# Altium schematic sheet Top.SchDoc
size A3
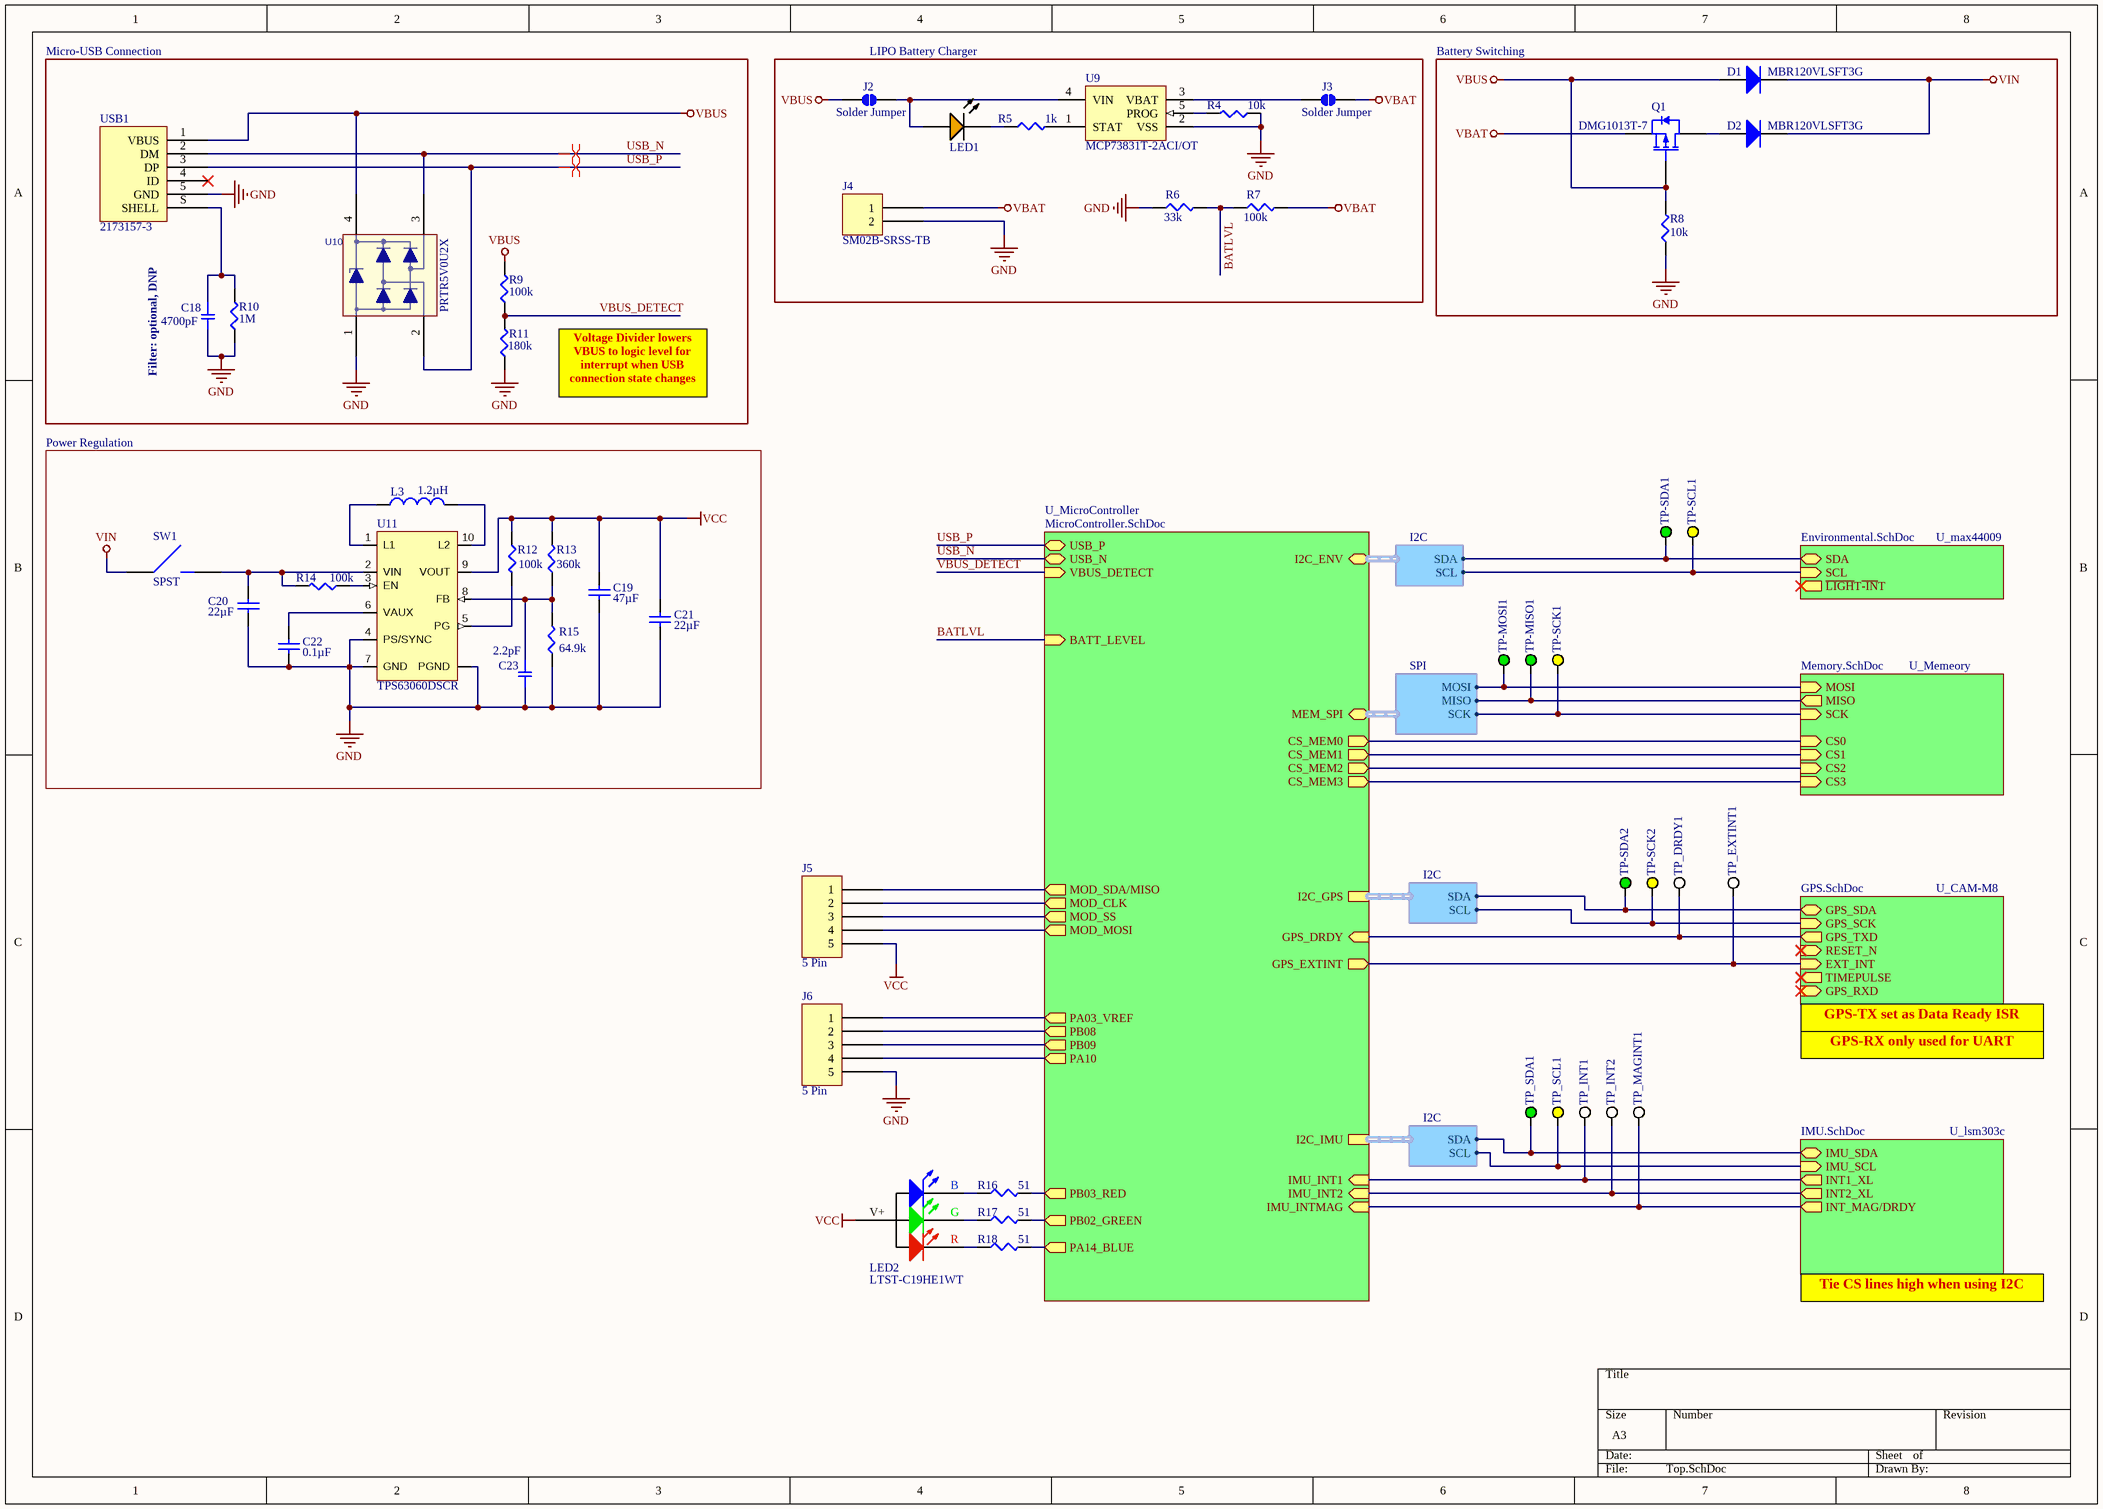
[diagram p0: Top.SchDoc]

## Parts
C18  value 4700pF  [SMD-0603C]  (hidden comment: GCM188R72A472KA37D)
C19  Capacitance: 47µF  [C0603N]  (hidden comment: CL21A476MQCLRNC)
C20  Capacitance: 22µF  [C0603N]  (hidden comment: CL21A226MQCLQNC)
C21  Capacitance: 22µF  [C0603N]  (hidden comment: CL21A226MQCLQNC)
C22  Capacitance: 0.1µF  [C0603N]  (hidden comment: CL10B104KO8NFNC)
C23  value 2.2pF  [SMD-0603C]  (hidden comment: GRM1885C1H2R2BA01D)
D1  MBR120VLSFT3G  [MBR120VLSFT3G]
D2  MBR120VLSFT3G  [MBR120VLSFT3G]
J2  Solder Jumper  [Jumper_1.5x3]
J3  Solder Jumper  [Jumper_1.5x3]
J4  SM02B-SRSS-TB  [JST SM02B-SRSS-TB]
J5  5 Pin  [PINHEAD127_1x5]
J6  5 Pin  [PINHEAD127_1x5]
L3  Inductance: 1.2µH  [IND_BOURNS_SRP40]  (hidden comment: SRP4020-1R2M)
LED1  LTST-C190KFKT  [LED_0603]  (value not drawn)
LED2  LTST-C19HE1WT  [LED_0606_160X160X35]
Q1  DMG1013T-7  [SOT50P175X90-3N]
R4  value 10k  [SMD-0603-RES]  (hidden comment: ERJ-3EKF1002V)
R5  value 1k  [SMD-0603-RES]  (hidden comment: ERJ-3EKF1001V)
R6  value 33k  [SMD-0603-RES]  (hidden comment: ERJ-3EKF3302V)
R7  value 100k  [SMD-0603-RES]  (hidden comment: ERJ-3EKF1003V)
R8  value 10k  [SMD-0603-RES]  (hidden comment: ERJ-3EKF1002V)
R9  value 100k  [SMD-0603-RES]  (hidden comment: ERJ-3EKF1003V)
R10  value 1M  [SMD-0603-RES]  (hidden comment: ERJ-3EKF1004V)
R11  value 180k  [SMD-0603-RES]  (hidden comment: ERJ-3EKF1803V)
R12  value 100k  [R0603N]  (hidden comment: ERJ-3EKF1003V)
R13  value 360k  [SMD-0603-RES]  (hidden comment: ERJ-3EKF3603V)
R14  value 100k  [R0603N]  (hidden comment: ERJ-3EKF1003V)
R15  value 64.9k  [SMD-0603-RES]  (hidden comment: ERJ-3EKF6492V)
R16  value 51  [SMD-0603-RES]  (hidden comment: ERJ-3EKF51R0V)
R17  value 51  [SMD-0603-RES]  (hidden comment: ERJ-3EKF51R0V)
R18  value 51  [SMD-0603-RES]  (hidden comment: ERJ-3EKF51R0V)
SW1  SPST  [PINHEAD254_1x2]
TP-MISO1  Test Point  [tp_30mil]  (value not drawn)
TP-MOSI1  Test Point  [tp_30mil]  (value not drawn)
TP-SCK1  Test Point  [tp_30mil]  (value not drawn)
TP-SCK2  Test Point  [tp_30mil]  (value not drawn)
TP-SCL1  Test Point  [tp_30mil]  (value not drawn)
TP-SDA1  Test Point  [tp_30mil]  (value not drawn)
TP-SDA2  Test Point  [tp_30mil]  (value not drawn)
TP_DRDY1  Test Point  [tp_30mil]  (value not drawn)
TP_EXTINT1  Test Point  [tp_30mil]  (value not drawn)
TP_INT1  Test Point  [tp_30mil]  (value not drawn)
TP_INT2  Test Point  [tp_30mil]  (value not drawn)
TP_MAGINT1  Test Point  [tp_30mil]  (value not drawn)
TP_SCL1  Test Point  [tp_30mil]  (value not drawn)
TP_SDA1  Test Point  [tp_30mil]  (value not drawn)
U9  MCP73831T-2ACI/OT  [SOT-23-5_MC]
U10  PRTR5V0U2X  [SOT143B]
U11  TPS63060DSCR  [TI_DRC_S-PVSON-N10]
USB1  2173157-3  [CONN_2173157]

## Blocks framed on the sheet
LIPO Battery Charger: J2-J4 LED1 R4-R7 U9
Battery Switching: D1 D2 Q1 R8
Power Regulation: C19-C23 L3 R12-R15 SW1 U11

## Sub-sheets
U_CAM-M8 = GPS.SchDoc: GPS_SCK (in), GPS_SDA (bidir), EXT_INT (in), TIMEPULSE (out), GPS_RXD (in), GPS_TXD (out), RESET_N (in)
U_lsm303c = IMU.SchDoc: IMU_SCL (in), IMU_SDA (bidir), INT1_XL (out), INT_MAG/DRDY (out), INT2_XL (out)
U_max44009 = Environmental.SchDoc: SDA (bidir), SCL (in), ~{LIGH}T~{-IN}T (out)
U_Memeory = Memory.SchDoc: MISO (out), SCK (in), MOSI (in), CS3 (in), CS1 (in), CS2 (in), CS0 (in)
U_MicroController = MicroController.SchDoc: USB_P (bidir), USB_N (bidir), I2C_GPS (harness I2C), VBUS_DETECT (in), BATT_LEVEL (in), GPS_DRDY (in), GPS_EXTINT (out), I2C_IMU (harness I2C), IMU_INT1 (in), IMU_INT2 (in), IMU_INTMAG (in), I2C_ENV (harness I2C), PB03_RED (out), PB02_GREEN (out), MEM_SPI (harness SPI), PA14_BLUE (out), PA10 (out), PA03_VREF (out), MOD_CLK (out), PB08 (out), MOD_MOSI (out), MOD_SS (out), PB09 (out), MOD_SDA/MISO (out), CS_MEM2 (out), CS_MEM1 (out), CS_MEM3 (out), CS_MEM0 (out)

## Harnesses
SPI: MOSI, MISO, SCK
I2C: SCL, SDA

## Nets
GND: C18.2 C19.2 C20.2 C21.2 C22.2 C23.2 J4.2 J6.5 R4.1 R6.1 R8.1 R10.1 R11.1 R15.1 U9.2(VSS) U10.1(GND) U11.4(PS/SYNC) U11.7(GND) U11.11(PGND) USB1.5(GND)
VBAT: J3.2 J4.1 Q1.2(S) R7.2
VBUS: D1.1(A) J2.1 Q1.1(G) R8.2 R9.2 U10.4(VCC) USB1.1(VBUS)
VCC: C19.1 C21.1 J5.5 LED2.4(A) R12.1 R13.2 U11.9(VOUT)
VIN: D1.2(K) D2.2(K) SW1.1
BATLVL: R6.2 R7.1 ; sheet U_MicroController/BATT_LEVEL
USB_N: U10.3(I/O2) USB1.2(DM) ; sheet U_MicroController/USB_N
USB_P: U10.2(I/O1) USB1.3(DP) ; sheet U_MicroController/USB_P
VBUS_DETECT: R9.1 R11.2 ; sheet U_MicroController/VBUS_DETECT
NetC18_1: C18.1 R10.2 USB1.S(SHELL)
NetC20_1: C20.1 R14.2 SW1.2 U11.2(VIN)
NetC22_1: C22.1 U11.6(VAUX)
NetC23_1: C23.1 R13.1 R15.2 U11.8(FB)
NetD2_1: D2.1(A) Q1.3(D)
NetJ2_2: J2.2 LED1.1(A) U9.4(VIN)
NetJ3_1: J3.1 U9.3(VBAT)
NetJ5_1: J5.1 ; sheet U_MicroController/MOD_SDA/MISO
NetJ5_2: J5.2 ; sheet U_MicroController/MOD_CLK
NetJ5_3: J5.3 ; sheet U_MicroController/MOD_SS
NetJ5_4: J5.4 ; sheet U_MicroController/MOD_MOSI
NetJ6_1: J6.1 ; sheet U_MicroController/PA03_VREF
NetJ6_2: J6.2 ; sheet U_MicroController/PB08
NetJ6_3: J6.3 ; sheet U_MicroController/PB09
NetJ6_4: J6.4 ; sheet U_MicroController/PA10
NetL3_1: L3.1 U11.1(L1)
NetL3_2: L3.2 U11.10(L2)
NetLED1_2: LED1.2(K) R5.1
NetLED2_1: LED2.1(R) R18.1
NetLED2_2: LED2.2(G) R17.1
NetLED2_3: LED2.3(B) R16.1
NetR4_2: R4.2 U9.5(PROG)
NetR5_2: R5.2 U9.1(STAT)
NetR12_2: R12.2 U11.5(PG)
NetR14_1: R14.1 U11.3(EN)
NetR16_2: R16.2 ; sheet U_MicroController/PB03_RED
NetR17_2: R17.2 ; sheet U_MicroController/PB02_GREEN
NetR18_2: R18.2 ; sheet U_MicroController/PA14_BLUE
NetTP-MISO1_1: TP-MISO1.1 ; sheet U_Memeory/MISO, sheet U_MicroController/MEM_SPI.MISO
NetTP-MOSI1_1: TP-MOSI1.1 ; sheet U_Memeory/MOSI, sheet U_MicroController/MEM_SPI.MOSI
NetTP-SCK1_1: TP-SCK1.1 ; sheet U_Memeory/SCK, sheet U_MicroController/MEM_SPI.SCK
NetTP-SCK2_1: TP-SCK2.1 ; sheet U_CAM-M8/GPS_SCK, sheet U_MicroController/I2C_GPS.SCL
NetTP-SCL1_1: TP-SCL1.1 ; sheet U_max44009/SCL, sheet U_MicroController/I2C_ENV.SCL
NetTP-SDA1_1: TP-SDA1.1 ; sheet U_max44009/SDA, sheet U_MicroController/I2C_ENV.SDA
NetTP-SDA2_1: TP-SDA2.1 ; sheet U_CAM-M8/GPS_SDA, sheet U_MicroController/I2C_GPS.SDA
NetTP_DRDY1_1: TP_DRDY1.1 ; sheet U_CAM-M8/GPS_TXD, sheet U_MicroController/GPS_DRDY
NetTP_EXTINT1_1: TP_EXTINT1.1 ; sheet U_CAM-M8/EXT_INT, sheet U_MicroController/GPS_EXTINT
NetTP_INT1_1: TP_INT1.1 ; sheet U_lsm303c/INT1_XL, sheet U_MicroController/IMU_INT1
NetTP_INT2_1: TP_INT2.1 ; sheet U_lsm303c/INT2_XL, sheet U_MicroController/IMU_INT2
NetTP_MAGINT1_1: TP_MAGINT1.1 ; sheet U_lsm303c/INT_MAG/DRDY, sheet U_MicroController/IMU_INTMAG
NetTP_SCL1_1: TP_SCL1.1 ; sheet U_lsm303c/IMU_SCL, sheet U_MicroController/I2C_IMU.SCL
NetTP_SDA1_1: TP_SDA1.1 ; sheet U_lsm303c/IMU_SDA, sheet U_MicroController/I2C_IMU.SDA
(unnamed): sheet U_Memeory/CS3, sheet U_MicroController/CS_MEM3
(unnamed): sheet U_Memeory/CS1, sheet U_MicroController/CS_MEM1
(unnamed): sheet U_Memeory/CS2, sheet U_MicroController/CS_MEM2
(unnamed): sheet U_Memeory/CS0, sheet U_MicroController/CS_MEM0

Not connected (* = marked no-connect by the designer): USB1 4(ID)*

## Layout directives
differential pair: USB_N, USB_P

## Notes on the sheet
- Micro-USB Connection
- Filter: optional, DNP
- Voltage Divider lowers VBUS to logic level for interrupt when USB connection state changes
- GPS-RX only used for UART
- GPS-TX set as Data Ready ISR
- Tie CS lines high when using I2C
- (in symbol LTST-C19HE1WT) V+

## Library data of the parts
C18 = GCM188R72A472KA37D: CAP CER 4700PF 100V X7R 0603; Manufacturer: Murata Electronics North America; Factory Stock: 0; Unit Price (USD): 0.1; Minimum Quantity: 1; Tolerance: ±10%; Datasheets: http://www.murata.com/~/media/webrenewal/support/library/catalog/products/capacitor/mlcc/c03e.ashx; Image: //media.digikey.com/Renders/Murata%20Renders/0603%28GCM188%29.jpg; Digi-Key Part Number: 490-4930-1-ND; Part Number: GCM188R72A472KA37D; Quantity Available: 3550; @ qty: 0; Packaging: Cut Tape (CT); Series: GCM; Part Status: Active; Voltage: 100V; Temperature Coefficient: X7R; Operating Temperature: -55°C ~ 125°C; Features: -; Ratings: AEC-Q200; Applications: Automotive; Mounting Type: Surface Mount, MLCC; Package / Case: 0603 (1608 Metric); Size / Dimension: 0.063" L x 0.031" W (1.60mm x 0.80mm); Height - Seated (Max): -; Thickness (Max): 0.035" (0.90mm); Lead Spacing: -; Lead Style: -
C19-C21 = CAPACITOR_NP: HOUSEPART: NO; POPULATE: 1; TOLERANCE: ±20%; VOLTAGE: 6.3V; Temperature Coefficient: X5R; LibraryName: MF_Passives; DeviceSetName: CAPACITOR_NP
  C19: DeviceName: CL21A476MQCLRNC; MPN: CL21A476MQCLRNC; URL: https://octopart.com/cl21a476mqclrnc-samsung-24871259; MF_PARTNUM: CL21A476MQCLRNC
  C20: DeviceName: CL21A226MQCLQNC; MPN: CL21A226MQCLQNC; URL: https://octopart.com/cl21a226mqclqnc-samsung-19832203; MF_PARTNUM: CL21A226MQCLQNC
  C21: DeviceName: CL21A226MQCLQNC; MPN: CL21A226MQCLQNC; URL: https://octopart.com/cl21a476mqclrnc-samsung-24871259; MF_PARTNUM: CL21A226MQCLQNC
C22 = CAPACITOR_NP: HOUSEPART: NO; POPULATE: 1; TOLERANCE: ±10%; VOLTAGE: 16V; Temperature Coefficient: X7R; DeviceName: CL10B104KO8NFNC; LibraryName: MF_Passives; DeviceSetName: CAPACITOR_NP; MPN: CL10B104KO8NFNC; URL: https://octopart.com/cl10b104ko8nfnc-samsung-19831587; MF_PARTNUM: CL10B104KO8NFNC
C23 = GRM1885C1H2R2BA01D: CAP CER 2.2PF 50V NP0 0603; Manufacturer: Murata Electronics North America; Factory Stock: 0; Unit Price (USD): 0.11; Minimum Quantity: 1; Tolerance: ±0.1pF; Temperature Coefficient: C0G, NP0; Datasheets: http://www.murata.com/~/media/webrenewal/support/library/catalog/products/capacitor/mlcc/c02e.pdf; Image: //media.digikey.com/Renders/Murata%20Renders/ZRB-SERIES-0402.jpg; Digi-Key Part Number: 490-12719-1-ND; Part Number: GRM1885C1H2R2BA01D; Quantity Available: 2033; @ qty: 0; Packaging: Cut Tape (CT); Series: GRM; Part Status: Active; Voltage: 50V; Operating Temperature: -55°C ~ 125°C; Features: -; Ratings: -; Applications: General Purpose; Mounting Type: Surface Mount, MLCC; Package / Case: 0603 (1608 Metric); Size / Dimension: 0.063" L x 0.031" W (1.60mm x 0.80mm); Height - Seated (Max): -; Thickness (Max): 0.035" (0.90mm); Lead Spacing: -; Lead Style: -
D1 D2 = MBR120VLSFT3G: Diode Schottky 20V 1A Surface Mount SOD-123FL; Manufacturer Part Number: MBR120VLSFT3G
J2 J3 = solderJumper
J4 = 2 Pin: Part Number: SM02B-SRSS-TB
L3 = SRP4020-1R2M: C: Copyright (C) 2015 Accelerated Designs. All rights reserved; Vendor: Bourns Electronics; Built_By: EMA_UL_Team; Type: Wirewound; Tolerance: ±20%; Current Rating: 5A; DC Resistance (DCR): 22 mOhm Max; Inductance Frequency - Test: 100kHz; Manufacturer Part Number: SRP4020-1R2M
LED1 = CMP-1544850-3: LED Uni-Color Orange, 75 mW, 30 mA; Forward Voltage: 2.00 V; Luminous Intensity: 60.0 mcd; Lens Type: Non-Diffused; Wavelength: 611 nm; Viewing Angle: 130 °; Lead-Free Status: Lead Free; Case/Package (SI): 1608; Size-Width: 800 µm; PackageReference: C190KFKT; Size-Height: 800 µm; Color: Orange; Packaging: Cut Tape (CT), Tape & Reel (TR); RoHS: Compliant; Seller Landing  Url: https://octopart-clicks.com/click/track?country=US&ak=8157f166&sig=0e2a9b5&sid=459&ppid=549896&vpid=1324662&ct=offers; Octopart Url: http://octopart.com/ltst-c190kfkt-lite-on-549896; Mounting Style: Surface Mount, Vertical; OctopartID: 99ca50c8d8a4460d; DatasheetVersion: Rev. I, 09/2011; Manufacturer Part Number: LTST-C190KFKT; Case/Package: 0603; Size-Length: 1.60 mm; PackageDescription: 2-Pin Surface Mount Device, Body 1.6 x 0.8 mm
LED2 = LTST-C19HE1WT: RGB LED 0606 (1616 metric); Lead-Free Status: Lead Free; Wavelength - Dominant: 624nm Red, 525nm Green, 470nm Blue; package metric: 1616; Configuration: Common Anode; Octopart URL: http://octopart.com/ltst-c19he1wt-lite-on-13128904; OctopartID: 1946d08468e8c681; RoHS: Compliant; Manufacturer Part Number: LTST-C19HE1WT; package: 0606; supplier 1: Digikey; Supplier Part Number: 160-2162-1-ND; Height (Max): 0.45mm; Mounting Type: SMT
Q1 = DMG1013T-7c2930a883c7b1d54: P-Channel SOT-523; Lead-Free Status: Lead Free; RoHS: Compliant; Lifecycle Status: Active; Polarity: P-Channel; Manufacturer Part Number: DMG1013T-7; REACH SVHC Compliance: No SVHC; Octopart URL: http://octopart.com/dmg1013t-7-diodes+inc.-17947534; OctopartID: c2930a883c7b1d54
R4 R8 = ERJ-3EKF1002V: RES SMD 10K OHM 1% 1/10W 0603; Manufacturer: Panasonic Electronic Components; Factory Stock: 0; Unit Price (USD): 0.00379; @ qty: 1500; Minimum Quantity: 1; Power (Watts): 0.1W, 1/10W; Temperature Coefficient: ±100ppm/°C; Part Number: ERJ-3EKF1002V; Datasheets: http://industrial.panasonic.com/www-cgi/jvcr13pz.cgi?E+PZ+3+AOA0002+ERJ3EKF1002V+7+WW; Image: //media.digikey.com/Photos/Panasonic%20Photos/MFG_ERJ-P6W%20Series.jpg; Digi-Key Part Number: P10.0KHCT-ND; Quantity Available: 6703141; Packaging: Cut Tape (CT); Series: ERJ; Part Status: Active; Tolerance: ±1%; Composition: Thick Film; Features: Automotive AEC-Q200; Operating Temperature: -55°C ~ 155°C; Package / Case: 0603 (1608 Metric); Supplier Device Package: 0603; Size / Dimension: 0.063" L x 0.031" W (1.60mm x 0.80mm); Height - Seated (Max): 0.022" (0.55mm); Number of Terminations: 2; Failure Rate: -
R5 = ERJ-3EKF1001V: RES SMD 1K OHM 1% 1/10W 0603; Manufacturer: Panasonic Electronic Components; Factory Stock: 0; Unit Price (USD): 0.00379; @ qty: 1500; Minimum Quantity: 1; Power (Watts): 0.1W, 1/10W; Temperature Coefficient: ±100ppm/°C; Part Number: ERJ-3EKF1001V; Datasheets: http://industrial.panasonic.com/www-cgi/jvcr13pz.cgi?E+PZ+3+AOA0002+ERJ3EKF1001V+7+WW; Image: //media.digikey.com/Photos/Panasonic%20Photos/MFG_ERJ-P6W%20Series.jpg; Digi-Key Part Number: P1.00KHCT-ND; Quantity Available: 5218845; Packaging: Cut Tape (CT); Series: ERJ; Part Status: Active; Tolerance: ±1%; Composition: Thick Film; Features: Automotive AEC-Q200; Operating Temperature: -55°C ~ 155°C; Package / Case: 0603 (1608 Metric); Supplier Device Package: 0603; Size / Dimension: 0.063" L x 0.031" W (1.60mm x 0.80mm); Height - Seated (Max): 0.022" (0.55mm); Number of Terminations: 2; Failure Rate: -
R6 = ERJ-3EKF3302V: RES SMD 33K OHM 1% 1/10W 0603; Manufacturer: Panasonic Electronic Components; Factory Stock: 0; Unit Price (USD): 0.00379; @ qty: 1500; Minimum Quantity: 1; Power (Watts): 0.1W, 1/10W; Temperature Coefficient: ±100ppm/°C; Part Number: ERJ-3EKF3302V; Datasheets: http://industrial.panasonic.com/www-cgi/jvcr13pz.cgi?E+PZ+3+AOA0002+ERJ3EKF3302V+7+WW; Image: //media.digikey.com/Photos/Panasonic%20Photos/MFG_ERJ-P6W%20Series.jpg; Digi-Key Part Number: P33.0KHCT-ND; Quantity Available: 240194; Packaging: Cut Tape (CT); Series: ERJ; Part Status: Active; Tolerance: ±1%; Composition: Thick Film; Features: Automotive AEC-Q200; Operating Temperature: -55°C ~ 155°C; Package / Case: 0603 (1608 Metric); Supplier Device Package: 0603; Size / Dimension: 0.063" L x 0.031" W (1.60mm x 0.80mm); Height - Seated (Max): 0.022" (0.55mm); Number of Terminations: 2; Failure Rate: -
R7 R9 R12 R14 = ERJ-3EKF1003V: RES SMD 100K OHM 1% 1/10W 0603; Manufacturer: Panasonic Electronic Components; Factory Stock: 0; Unit Price (USD): 0.00379; @ qty: 1500; Minimum Quantity: 1; Power (Watts): 0.1W, 1/10W; Temperature Coefficient: ±100ppm/°C; Part Number: ERJ-3EKF1003V; Datasheets: http://industrial.panasonic.com/www-cgi/jvcr13pz.cgi?E+PZ+3+AOA0002+ERJ3EKF1003V+7+WW; Image: //media.digikey.com/Photos/Panasonic%20Photos/MFG_ERJ-P6W%20Series.jpg; Digi-Key Part Number: P100KHCT-ND; Quantity Available: 2179804; Packaging: Cut Tape (CT); Series: ERJ; Part Status: Active; Tolerance: ±1%; Composition: Thick Film; Features: Automotive AEC-Q200; Operating Temperature: -55°C ~ 155°C; Package / Case: 0603 (1608 Metric); Supplier Device Package: 0603; Size / Dimension: 0.063" L x 0.031" W (1.60mm x 0.80mm); Height - Seated (Max): 0.022" (0.55mm); Number of Terminations: 2; Failure Rate: -
R10 = ERJ-3EKF1004V: RES SMD 1M OHM 1% 1/10W 0603; Manufacturer: Panasonic Electronic Components; Factory Stock: 0; Unit Price (USD): 0.00379; @ qty: 1500; Minimum Quantity: 1; Power (Watts): 0.1W, 1/10W; Temperature Coefficient: ±100ppm/°C; Part Number: ERJ-3EKF1004V; Datasheets: http://industrial.panasonic.com/www-cgi/jvcr13pz.cgi?E+PZ+3+AOA0002+ERJ3EKF1004V+7+WW; Image: //media.digikey.com/Photos/Panasonic%20Photos/MFG_ERJ-P6W%20Series.jpg; Digi-Key Part Number: P1.00MHCT-ND; Quantity Available: 1632074; Packaging: Cut Tape (CT); Series: ERJ; Part Status: Active; Tolerance: ±1%; Composition: Thick Film; Features: Automotive AEC-Q200; Operating Temperature: -55°C ~ 155°C; Package / Case: 0603 (1608 Metric); Supplier Device Package: 0603; Size / Dimension: 0.063" L x 0.031" W (1.60mm x 0.80mm); Height - Seated (Max): 0.022" (0.55mm); Number of Terminations: 2; Failure Rate: -
R11 = ERJ-3EKF1803V: RES SMD 180K OHM 1% 1/10W 0603; Manufacturer: Panasonic Electronic Components; Factory Stock: 0; Unit Price (USD): 0.00379; @ qty: 1500; Minimum Quantity: 1; Power (Watts): 0.1W, 1/10W; Temperature Coefficient: ±100ppm/°C; Part Number: ERJ-3EKF1803V; Datasheets: http://industrial.panasonic.com/www-cgi/jvcr13pz.cgi?E+PZ+3+AOA0002+ERJ3EKF1803V+7+WW; Image: //media.digikey.com/Photos/Panasonic%20Photos/MFG_ERJ-P6W%20Series.jpg; Digi-Key Part Number: P180KHCT-ND; Quantity Available: 74867; Packaging: Cut Tape (CT); Series: ERJ; Part Status: Active; Tolerance: ±1%; Composition: Thick Film; Features: Automotive AEC-Q200; Operating Temperature: -55°C ~ 155°C; Package / Case: 0603 (1608 Metric); Supplier Device Package: 0603; Size / Dimension: 0.063" L x 0.031" W (1.60mm x 0.80mm); Height - Seated (Max): 0.022" (0.55mm); Number of Terminations: 2; Failure Rate: -
R13 = ERJ-3EKF3603V: RES SMD 360K OHM 1% 1/10W 0603; Manufacturer: Panasonic Electronic Components; Factory Stock: 0; Unit Price (USD): 0.00379; @ qty: 1500; Minimum Quantity: 1; Power (Watts): 0.1W, 1/10W; Temperature Coefficient: ±100ppm/°C; Part Number: ERJ-3EKF3603V; Datasheets: http://industrial.panasonic.com/www-cgi/jvcr13pz.cgi?E+PZ+3+AOA0002+ERJ3EKF3603V+7+WW; Image: //media.digikey.com/Photos/Panasonic%20Photos/MFG_ERJ-P6W%20Series.jpg; Digi-Key Part Number: P360KHCT-ND; Quantity Available: 34696; Packaging: Cut Tape (CT); Series: ERJ; Part Status: Active; Tolerance: ±1%; Composition: Thick Film; Features: Automotive AEC-Q200; Operating Temperature: -55°C ~ 155°C; Package / Case: 0603 (1608 Metric); Supplier Device Package: 0603; Size / Dimension: 0.063" L x 0.031" W (1.60mm x 0.80mm); Height - Seated (Max): 0.022" (0.55mm); Number of Terminations: 2; Failure Rate: -
R15 = ERJ-3EKF6492V: RES SMD 64.9K OHM 1% 1/10W 0603; Manufacturer: Panasonic Electronic Components; Factory Stock: 0; Unit Price (USD): 0.00379; @ qty: 1500; Minimum Quantity: 1; Power (Watts): 0.1W, 1/10W; Temperature Coefficient: ±100ppm/°C; Part Number: ERJ-3EKF6492V; Datasheets: http://industrial.panasonic.com/www-cgi/jvcr13pz.cgi?E+PZ+3+AOA0002+ERJ3EKF6492V+7+WW; Image: //media.digikey.com/Photos/Panasonic%20Photos/MFG_ERJ-P6W%20Series.jpg; Digi-Key Part Number: P64.9KHCT-ND; Quantity Available: 58875; Packaging: Cut Tape (CT); Series: ERJ; Part Status: Active; Tolerance: ±1%; Composition: Thick Film; Features: Automotive AEC-Q200; Operating Temperature: -55°C ~ 155°C; Package / Case: 0603 (1608 Metric); Supplier Device Package: 0603; Size / Dimension: 0.063" L x 0.031" W (1.60mm x 0.80mm); Height - Seated (Max): 0.022" (0.55mm); Number of Terminations: 2; Failure Rate: -
R16-R18 = ERJ-3EKF51R0V: RES SMD 51 OHM 1% 1/10W 0603; Manufacturer: Panasonic Electronic Components; Factory Stock: 0; Unit Price (USD): 0.00379; @ qty: 1500; Minimum Quantity: 1; Power (Watts): 0.1W, 1/10W; Temperature Coefficient: ±100ppm/°C; Part Number: ERJ-3EKF51R0V; Datasheets: http://industrial.panasonic.com/www-cgi/jvcr13pz.cgi?E+PZ+3+AOA0002+ERJ3EKF51R0V+7+WW; Image: //media.digikey.com/Photos/Panasonic%20Photos/MFG_ERJ-P6W%20Series.jpg; Digi-Key Part Number: P51.0HCT-ND; Quantity Available: 129747; Packaging: Cut Tape (CT); Series: ERJ; Part Status: Active; Tolerance: ±1%; Composition: Thick Film; Features: Automotive AEC-Q200; Operating Temperature: -55°C ~ 155°C; Package / Case: 0603 (1608 Metric); Supplier Device Package: 0603; Size / Dimension: 0.063" L x 0.031" W (1.60mm x 0.80mm); Height - Seated (Max): 0.022" (0.55mm); Number of Terminations: 2; Failure Rate: -
SW1 = SPST switch
TP-MISO1 TP-MOSI1 TP-SDA1 TP-SDA2 TP_SDA1 = testpoint_green: Test Point Green
TP-SCK1 TP-SCK2 TP-SCL1 TP_SCL1 = testpoint_yellow: Test Point Yellow
TP_DRDY1 TP_EXTINT1 TP_INT1 TP_INT2 TP_MAGINT1 = testpoint_white: Test Point White
U9 = MCHP-MCP73831T-5: MCP73831 Series Single-Cell Li-Ion/Li-Polymer Battery Charge Controller SOT-23-5; Input Voltage (DC): 3.75 V (min); Lead-Free Status: Lead Free; Supply Voltage (DC): 6.00 V (max); Output Voltage: 7.30 V; RoHS: Compliant; Octopart URL: https://octopart-clicks.com/click/track?country=US&ak=8157f166&sig=05342b1&sid=459&ppid=55392281&vpid=188043932&ct=offers; OctopartID: d79a1dddcae5085d; Manufacturer Part Number: MCP73831T-2ACI/OT; REACH SVHC Compliance: No SVHC; Case/Package: SOT-23; Lifecycle Status: Active; Packaging: Cut Tape (CT), Tape & Reel (TR); Number of Pins: 5; Mounting Style: Surface Mount; Octopart Url: http://octopart.com/mcp73831t-2aci%2Fot-microchip-55392281
U10 = PRTR5V0U2X: C: Copyright (C) 2015 Accelerated Designs. All rights reserved; Vendor: NXP; Built_By: EMA_UL_Team; Value: PRTR5V0U2X; Manufacturer_Part_Number: PRTR5V0U2X
U11 = TPS63060DSCR: 2.5V to 12V input voltage, 93% Efficient, 2.25A Switch Current Limit, Buck-Boost Converter 10-WSON -40 to 85; Manufacturer Part Number: TPS63060DSCR
USB1 = USB-CONN-2173157-3: Conn Micro USB 2.0 Type B Splash Proof; Lead-Free Status: Lead Free; ELV Compliant: Compliant; Gender: Female; Packaging: Tape & Reel (TR); Manufacturer Part Number: 2173157-3; Contact Plating: Gold; RoHS: Compliant; Octopart URL: https://octopart.com/2173157-3-te+connectivity-34977340; Housing Color: Black; Housing Material: Thermoplastic; Mounting Style: Surface Mount, Solder; Operating Temperature: -30.0 °C to 85.0 °C; Lifecycle Status: Not Listed by Manufacturer; OctopartID: 8f71446e1c2b50b6; Supplier Part Number: A124356CT-ND; Supplier 1: Digikey